# EasyEDA Pro project 2022-LC-MNT-3.eprj

# Schematic 【蓝桥杯练习题三】智能平衡小车
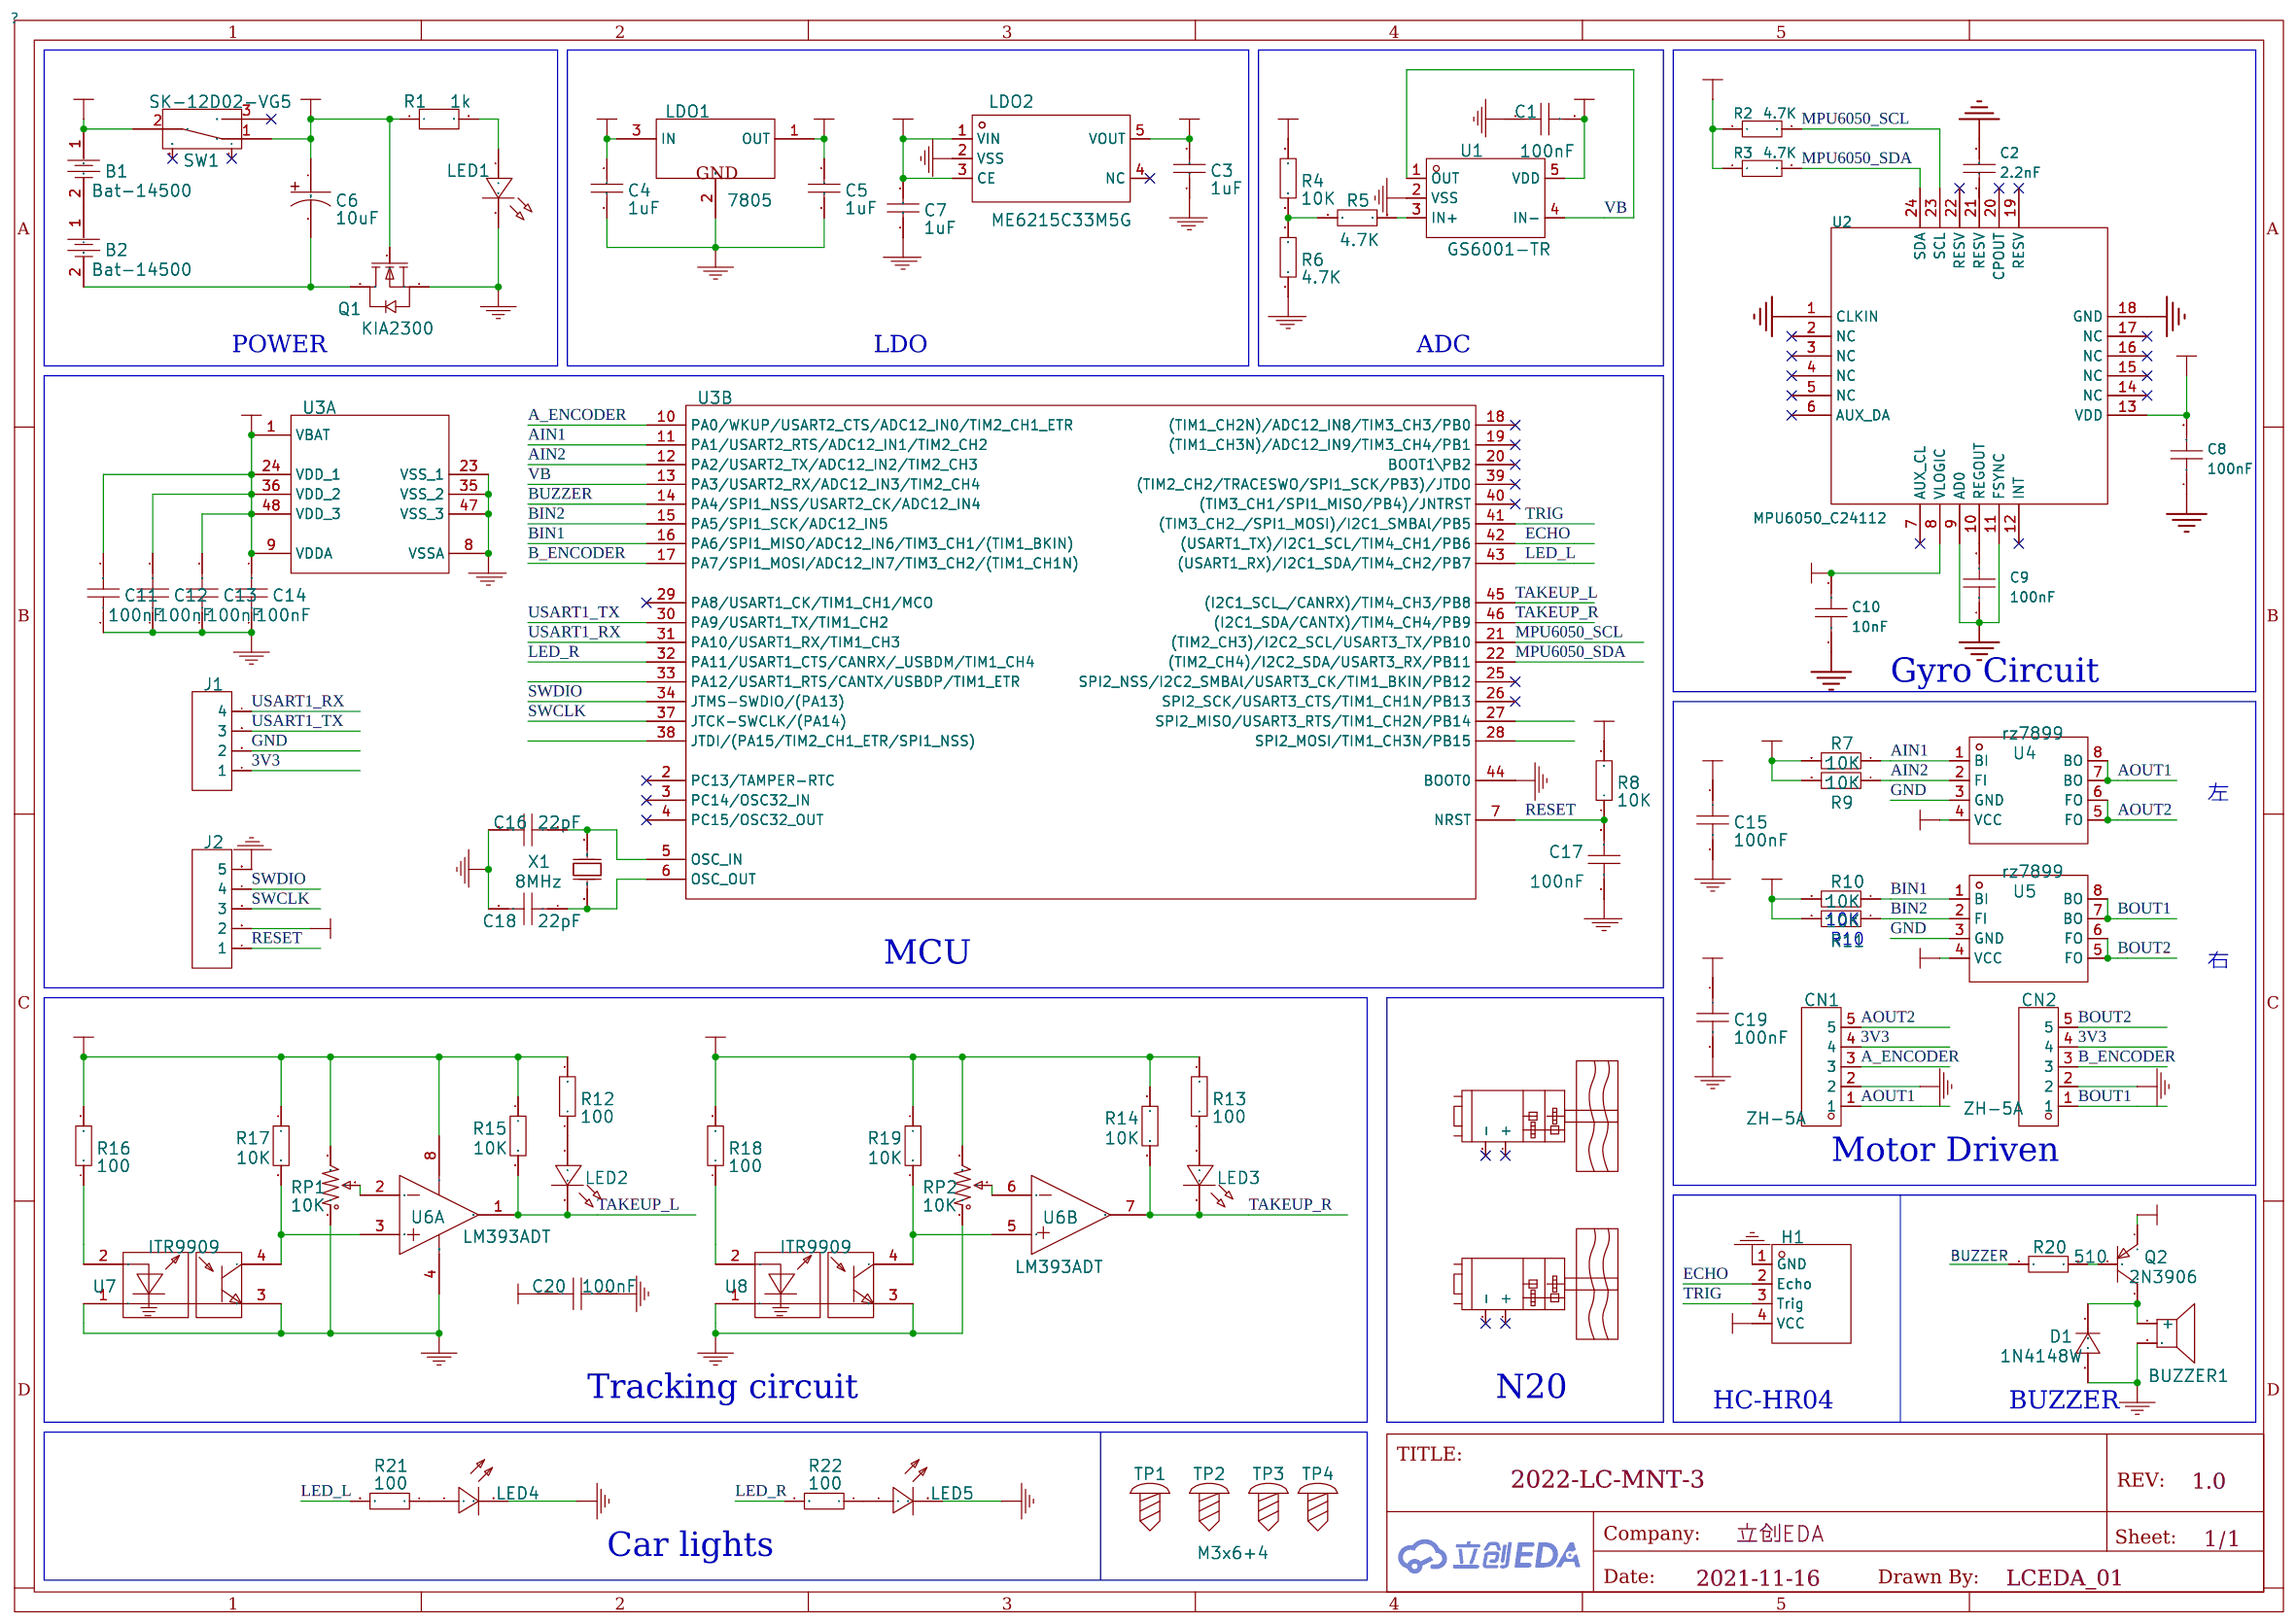
[diagram p0: schematic sheet]

## Parts
ASS_1  直流电机N20  [直流电机N20_水平装配]
ASS_2  直流电机N20  [直流电机N20_水平装配]
B1  Bat-14500  [BAT-5AA_JX]
B2  Bat-14500  [BAT-5AA_JX]
BUZZER1  TMB12A12  [BUZ-TH_BD12.0-P7.60-D0.6-FD]
C1  100nF  [C0603]
C2  2.2nF  [C0603]
C3  1uF  [C0603]
C4  1uF  [C0603]
C5  1uF  [C0603]
C6  10uF  [CAP-SMD_L3.2-W1.6]
C7  1uF  [C0603]
C8  100nF  [C0603]
C9  100nF  [C0603]
C10  10nF  [C0603]
C11  100nF  [C0603]
C12  100nF  [C0603]
C13  100nF  [C0603]
C14  100nF  [C0603]
C15  100nF  [C0603]
C16  22pF  [C0603]
C17  100nF  [C0603]
C18  22pF  [C0603]
C19  100nF  [C0603]
C20  100nF  [C0603]
CN1  ZH-5A  [CONN-TH_5P-P1.50_ZH-5A]
CN2  ZH-5A  [CONN-TH_5P-P1.50_ZH-5A]
D1  1N4148W  [SOD-123FL_L2.6-W1.6-LS3.4-RD]
H1  超声波测距模块_HC-HR04  [HC-HR04]
J1  HDR-M-2.54_1x4  [HDR-M-2.54_1X4]
J2  HDR-M-2.54_1x5  [HDR-M-2.54_1X5]
LDO1  7805  [SOT-89-3_L4.5-W2.5-P1.50-LS4.2-BR]
LDO2  ME6215C33M5G  [SOT-23-5_L3.0-W1.7-P0.95-LS2.8-BR]
LED1  LED-0603_R  [LED0603_RED]
LED2  LED-0805_G  [LED0603_GREEN]
LED3  LED-0805_G  [LED0603_GREEN]
LED4  TJ-L5FCMYGTDLSFLC6TW-A5  [LED-TH-5MM_P2.54-L]
LED5  TJ-L5FCMYGTDLSFLC6TW-A5  [LED-TH-5MM_P2.54-L]
Q1  KIA2300  [SOT-23_L2.9-W1.3-P1.90-LS2.4-BR]
Q2  2N3906  [SOT-23-3_L2.9-W1.6-P1.90-LS2.8-TR-CW]
R1  1k  [R0603]
R2  4.7K  [R0603]
R3  4.7K  [R0603]
R4  10K  [R0603]
R5  4.7K  [R0603]
R6  4.7K  [R0603]
R7  10K  [R0603]
R8  10K  [R0603]
R9  10K  [R0603]
R10  10K  [R0603]
R11  10K  [R0603]
R12  100  [R0603]
R13  100  [R0603]
R14  10K  [R0603]
R15  10K  [R0603]
R16  100  [R0603]
R17  10K  [R0603]
R18  100  [R0603]
R19  10K  [R0603]
R20  510  [R0603]
R21  100  [R0603]
R22  100  [R0603]
RP1  10K  [10K贴片可调电阻]
RP2  10K  [10K贴片可调电阻]
SW1  SK-12D02-VG5  [SW-TH_SK-12D02VG3]
TP1  M3x6+4  [M3铜柱]
TP2  M3x6+4  [M3铜柱]
TP3  M3x6+4  [M3铜柱]
TP4  M3x6+4  [M3铜柱]
U1  GS6001-TR  [SOT-23-5_L3.0-W1.7-P0.95-LS2.8-BR]
U2  MPU6050_C24112  [LQ-QFN-24]
U3  STM32F103C8T6  [LQFP-48_L7.0-W7.0-P0.50-LS9.0-BL]  (sections 1,2)
U4  rz7899  [SOP-8_L4.9-W3.9-P1.27-LS6.0-BL]
U5  rz7899  [SOP-8_L4.9-W3.9-P1.27-LS6.0-BL]
U6  LM393ADT  [SOIC-8_L4.9-W3.9-P1.27-LS6.0-BL]  (sections 1,2)
U7  ITR9909  [OPTO-TH_ITR9909]
U8  ITR9909  [OPTO-TH_ITR9909]
X1  8MHz  [OSC-SMD_L5.0-W3.2]

## Library data of the parts
ASS_1 ASS_2 = 直流电机N20
B1 B2 = Bat-14500
BUZZER1 = TMB12A12: Supplier: LCSC; Manufacturer: HNDZ; Supplier Part: C96079; JLCPCB Part Class: Extended Part
C1 C11-C15 C17 C19 C20 = CC0603KRX7R9BB104: Supplier: LCSC; Manufacturer: YAGEO; Supplier Part: C14663; JLCPCB Part Class: Basic Part
C2 = 2.2nF
C3-C5 C7 = CC0603KRX5R8BB105: Supplier: LCSC; Manufacturer: YAGEO; Supplier Part: C14664; JLCPCB Part Class: Extended Part
C6 = CA45-A-16V-10μF-K: Supplier: LCSC; Supplier Part: C185774; Manufacturer: TORCH; JLCPCB Part Class: Extended Part
C8 C9 = 100nF
C10 = 10nF
C16 C18 = CC0603FRNPO9BN220: Supplier: LCSC; Supplier Part: C326840; Manufacturer: YAGEO; JLCPCB Part Class: Extended Part
CN1 CN2 = ZH-5A: Supplier: LCSC; Manufacturer: BOOMELE; Supplier Part: C27580; JLCPCB Part Class: Extended Part
D1 = 1N4148W: Supplier: LCSC; Manufacturer: Tak Cheong; Supplier Part: C129216
H1 = 超声波测距模块_HC-HR04
J1 = HDR-M-2.54_1x4: Supplier Part: C124378; Supplier: LCSC
J2 = HDR-M-2.54_1x5: Supplier Part: C358687; Supplier: LCSC
LDO1 = CJ78L05: Supplier: LCSC; Manufacturer: CJ; image: //image.lceda.cn/szlcsc/C2079.jpg; Supplier Part: C2079; JLCPCB Part Class: Extend
LDO2 = ME6215C33M5G: Supplier: LCSC; Manufacturer: MICRONE; Supplier Part: C84119; JLCPCB Part Class: Extended Part
LED1 = 19-217/R6C-AL1M2VY/3T: Manufacturer: EVERLIGHT(台湾亿光); Supplier Part: C72044; Supplier: LCSC
LED2 LED3 = NCD0805G1: Manufacturer: 国星光电; Supplier Part: C84260
LED4 LED5 = TJ-L5FCMYGTDLSFLC6TW-A5: Supplier: LCSC; Supplier Part: C331025; Manufacturer: TOGIALED; JLCPCB SMD: Yes; JLCPCB Part Class: Extend
Q1 = KIA2300: Supplier: LCSC; Manufacturer: KIA; Supplier Part: C114186; JLCPCB Part Class: Extended Part
Q2 = 2N3906S-RTK/PS: Supplier: LCSC; Manufacturer: KEC; Supplier Part: C147294
R1 = 1k
R2 R3 = 4.7K
R4 R7-R11 R14 R15 R17 R19 = AR03BTCX1002: Supplier: LCSC; Supplier Part: C319939; Manufacturer: Viking Tech; JLCPCB Part Class: Extended Part
R5 R6 = RS-03K4701FT: Supplier: LCSC; Manufacturer: FH; Supplier Part: C116693; JLCPCB Part Class: Extended Part
R12 R13 R16 R18 R21 R22 = RS-03K101JT: Supplier: LCSC; Manufacturer: FH; Supplier Part: C86983; JLCPCB Part Class: Extended Part
R20 = ERJUP3J511V: Supplier: LCSC; Supplier Part: C543964; Manufacturer: PANASONIC
RP1 RP2 = 10K: Supplier: LCSC; Supplier Part: C515300
SW1 = SK-12D02-VG5: Supplier: LCSC; Supplier Part: C136722; Manufacturer: Rectangular Connectors - Contacts
TP1-TP4 = M3x6+4: Supplier Part: C551320
U1 = GS6001-TR: Supplier: LCSC; Manufacturer: Gainsil; Supplier Part: C157700; JLCPCB Part Class: Extended Part
U2 = MPU-6050_C24112
U3 = STM32F103C8T6: Supplier Part: C8734; Supplier: LCSC
U4 U5 = rz7899: Supplier: LCSC; Manufacturer: RZ; Supplier Part: C92373; JLCPCB Part Class: Extend; JLCPCB SMD: Yes
U6 = LM393ADT: Supplier Part: C136033; Supplier: LCSC; Manufacturer: STMicroelectronics
U7 U8 = ITR9909: Supplier: LCSC; Manufacturer: EVERLIGHT; Supplier Part: C53399; JLCPCB SMD: Yes; JLCPCB Part Class: Extend
X1 = X50328MSB2GI: Supplier: LCSC; Manufacturer: YXC; Supplier Part: C115962; JLCPCB Part Class: Basic Part

## Nets
3V3: C1.2 C3.2 C8.2 C10.2 C11.2 C12.2 C13.2 C14.2 C20.1 CN1.4 CN2.4 J1.1 J2.2 LDO2.5(VOUT) Q2.1(E) R2.1 R3.1 R7.2 R8.2 R9.2 R10.2 R11.2 R12.2 R13.2 R14.1 R15.1 R16.2 R17.1 R18.2 R19.1 RP1.3 RP2.3 U1.5(VDD) U2.8(VLOGIC) U2.13(VDD) U3.1(VBAT) U3.9(VDDA) U3.24(VDD_1) U3.36(VDD_2) U3.48(VDD_3) U6.8(V+)
+5V: C5.2 C7.2 H1.4(VCC) LDO1.1(OUT) LDO2.1(VIN) LDO2.3(CE)
GND: BUZZER1.2 C1.1 C2.2 C3.1 C4.1 C5.1 C7.1 C8.1 C9.1 C10.1 C11.1 C12.1 C13.1 C14.1 C15.2 C16.2 C17.1 C18.2 C19.2 C20.2 CN1.2 CN2.2 D1.2 H1.1(GND) J1.2 J2.5 LDO1.2(GND) LDO2.2(VSS) LED1.2 LED4.2 LED5.2 Q1.2(S) R6.1 RP1.1 RP2.1 U1.2(VSS) U2.1(CLKIN) U2.9(AD0) U2.11(FSYNC) U2.18(GND) U3.8(VSSA) U3.23(VSS_1) U3.35(VSS_2) U3.44(BOOT0) U3.47(VSS_3) U4.3(GND) U5.3(GND) U6.4(GND) U7.1 U7.3 U8.1 U8.3
VCC: C4.2 C6.1 C15.1 C19.1 LDO1.3(IN) Q1.1(G) R1.1 R4.1 SW1.1 U4.4(VCC) U5.4(VCC)
VCC_IN: B1.1 SW1.2
A_ENCODER: CN1.3 U3.10(PA0/WKUP/USART2_CTS/ADC12_IN0/TIM2_CH1_ETR)
AIN1: R7.1 U3.11(PA1/USART2_RTS/ADC12_IN1/TIM2_CH2) U4.1(BI)
AIN2: R9.1 U3.12(PA2/USART2_TX/ADC12_IN2/TIM2_CH3) U4.2(FI)
AOUT1: CN1.1 U4.7(BO) U4.8(BO)
AOUT2: CN1.5 U4.5(FO) U4.6(FO)
B_ENCODER: CN2.3 U3.17(PA7/SPI1_MOSI/ADC12_IN7/TIM3_CH2/(TIM1_CH1N))
BIN1: R10.1 U3.16(PA6/SPI1_MISO/ADC12_IN6/TIM3_CH1/(TIM1_BKIN)) U5.1(BI)
BIN2: R11.1 U3.15(PA5/SPI1_SCK/ADC12_IN5) U5.2(FI)
BOUT1: CN2.1 U5.7(BO) U5.8(BO)
BOUT2: CN2.5 U5.5(FO) U5.6(FO)
BUZZER: R20.1 U3.14(PA4/SPI1_NSS/USART2_CK/ADC12_IN4)
ECHO: H1.2(Echo) U3.42((USART1_TX)/I2C1_SCL/TIM4_CH1/PB6)
LED_L: R21.2 U3.43((USART1_RX)/I2C1_SDA/TIM4_CH2/PB7)
LED_R: R22.2 U3.32(PA11/USART1_CTS/CANRX/ USBDM/TIM1_CH4)
MPU6050_SCL: R2.2 U2.23(SCL) U3.21((TIM2_CH3)/I2C2_SCL/USART3_TX/PB10)
MPU6050_SDA: R3.2 U2.24(SDA) U3.22((TIM2_CH4)/I2C2_SDA/USART3_RX/PB11)
RESET: C17.2 J2.1 R8.1 U3.7(NRST)
SWCLK: J2.3 U3.37(JTCK-SWCLK/(PA14))
SWDIO: J2.4 U3.34(JTMS-SWDIO/(PA13))
TAKEUP_L: LED2.2 R15.2 U3.45((I2C1_SCL /CANRX)/TIM4_CH3/PB8) U6.1(OUT)
TAKEUP_R: LED3.2 R14.2 U3.46((I2C1_SDA/CANTX)/TIM4_CH4/PB9) U6.7(OUT)
TRIG: H1.3(Trig) U3.41((TIM3_CH2 /SPI1_MOSI)/I2C1_SMBAl/PB5)
USART1_RX: J1.4 U3.31(PA10/USART1_RX/TIM1_CH3)
USART1_TX: J1.3 U3.30(PA9/USART1_TX/TIM1_CH2)
VB: U1.1(OUT) U1.4(IN-) U3.13(PA3/USART2_RX/ADC12_IN3/TIM2_CH4)
$1N77: R5.2 U1.3(IN+)
$1N78: R4.2 R5.1 R6.2
$1N269: R16.1 U7.2
$1N271: R17.2 U6.3(IN+) U7.4
$1N290: RP1.2 U6.2(IN-)
$1N433: C18.1 U3.6(OSC_OUT) X1.1(OSC1)
$1N434: C16.1 U3.5(OSC_IN) X1.2(OSC2)
$1N816: B2.2 C6.2 Q1.3(D)
$1N817: LED1.1 R1.2
$1N876: RP2.2 U6.6(IN-)
$1N886: R19.2 U6.5(IN+) U8.4
$1N892: R18.1 U8.2
$1N1091: B1.2 B2.1
$1N1098: LED2.1 R12.1
$1N1111: LED4.1 R21.1
$1N1112: LED5.1 R22.1
$1N1113: LED3.1 R13.1
$1N2605: C2.1 U2.21(RESV)
$1N3949: C9.2 U2.10(REGOUT)
$1N4059: Q2.2(B) R20.2
$1N4066: BUZZER1.1(+) D1.1 Q2.3(C)

Not connected (* = marked no-connect by the designer): ASS_1 1(+)* 2(-)*; ASS_2 1(+)* 2(-)*; LDO2 4(NC)*; SW1 3* 4* 5*; U2 2(NC)* 3(NC)* 4(NC)* 5(NC)* 6(AUX_DA)* 7(AUX_CL)* 12(INT)* 14(NC)* 15(NC)* 16(NC)* 17(NC)* 19(RESV)* 20(CPOUT)* 22(RESV)*; U3 2(PC13/TAMPER-RTC)* 3(PC14/OSC32_IN)* 4(PC15/OSC32_OUT)* 18((TIM1_CH2N)/ADC12_IN8/TIM3_CH3/PB0)* 19((TIM1_CH3N)/ADC12_IN9/TIM3_CH4/PB1)* 20(BOOT1\PB2)* 25(SPI2_NSS/I2C2_SMBAl/USART3_CK/TIM1_BKIN/PB12)* 26(SPI2_SCK/USART3_CTS/TIM1_CH1N/PB13)* 27(SPI2_MISO/USART3_RTS/TIM1_CH2N/PB14) 28(SPI2_MOSI/TIM1_CH3N/PB15) 29(PA8/USART1_CK/TIM1_CH1/MCO)* 33(PA12/USART1_RTS/CANTX/USBDP/TIM1_ETR) 38(JTDI/(PA15/TIM2_CH1_ETR/SPI1_NSS)) 39((TIM2_CH2/TRACESWO/SPI1_SCK/PB3)/JTDO)* 40((TIM3_CH1/SPI1_MISO/PB4)/JNTRST)*

## Notes on the sheet
- POWER
- LDO
- ADC
- Gyro Circuit
- 左
- 10K
- R10
- MCU
- 右
- Motor Driven
- Tracking circuit
- N20
- HC-HR04
- BUZZER
- Car lights

# Board PCB
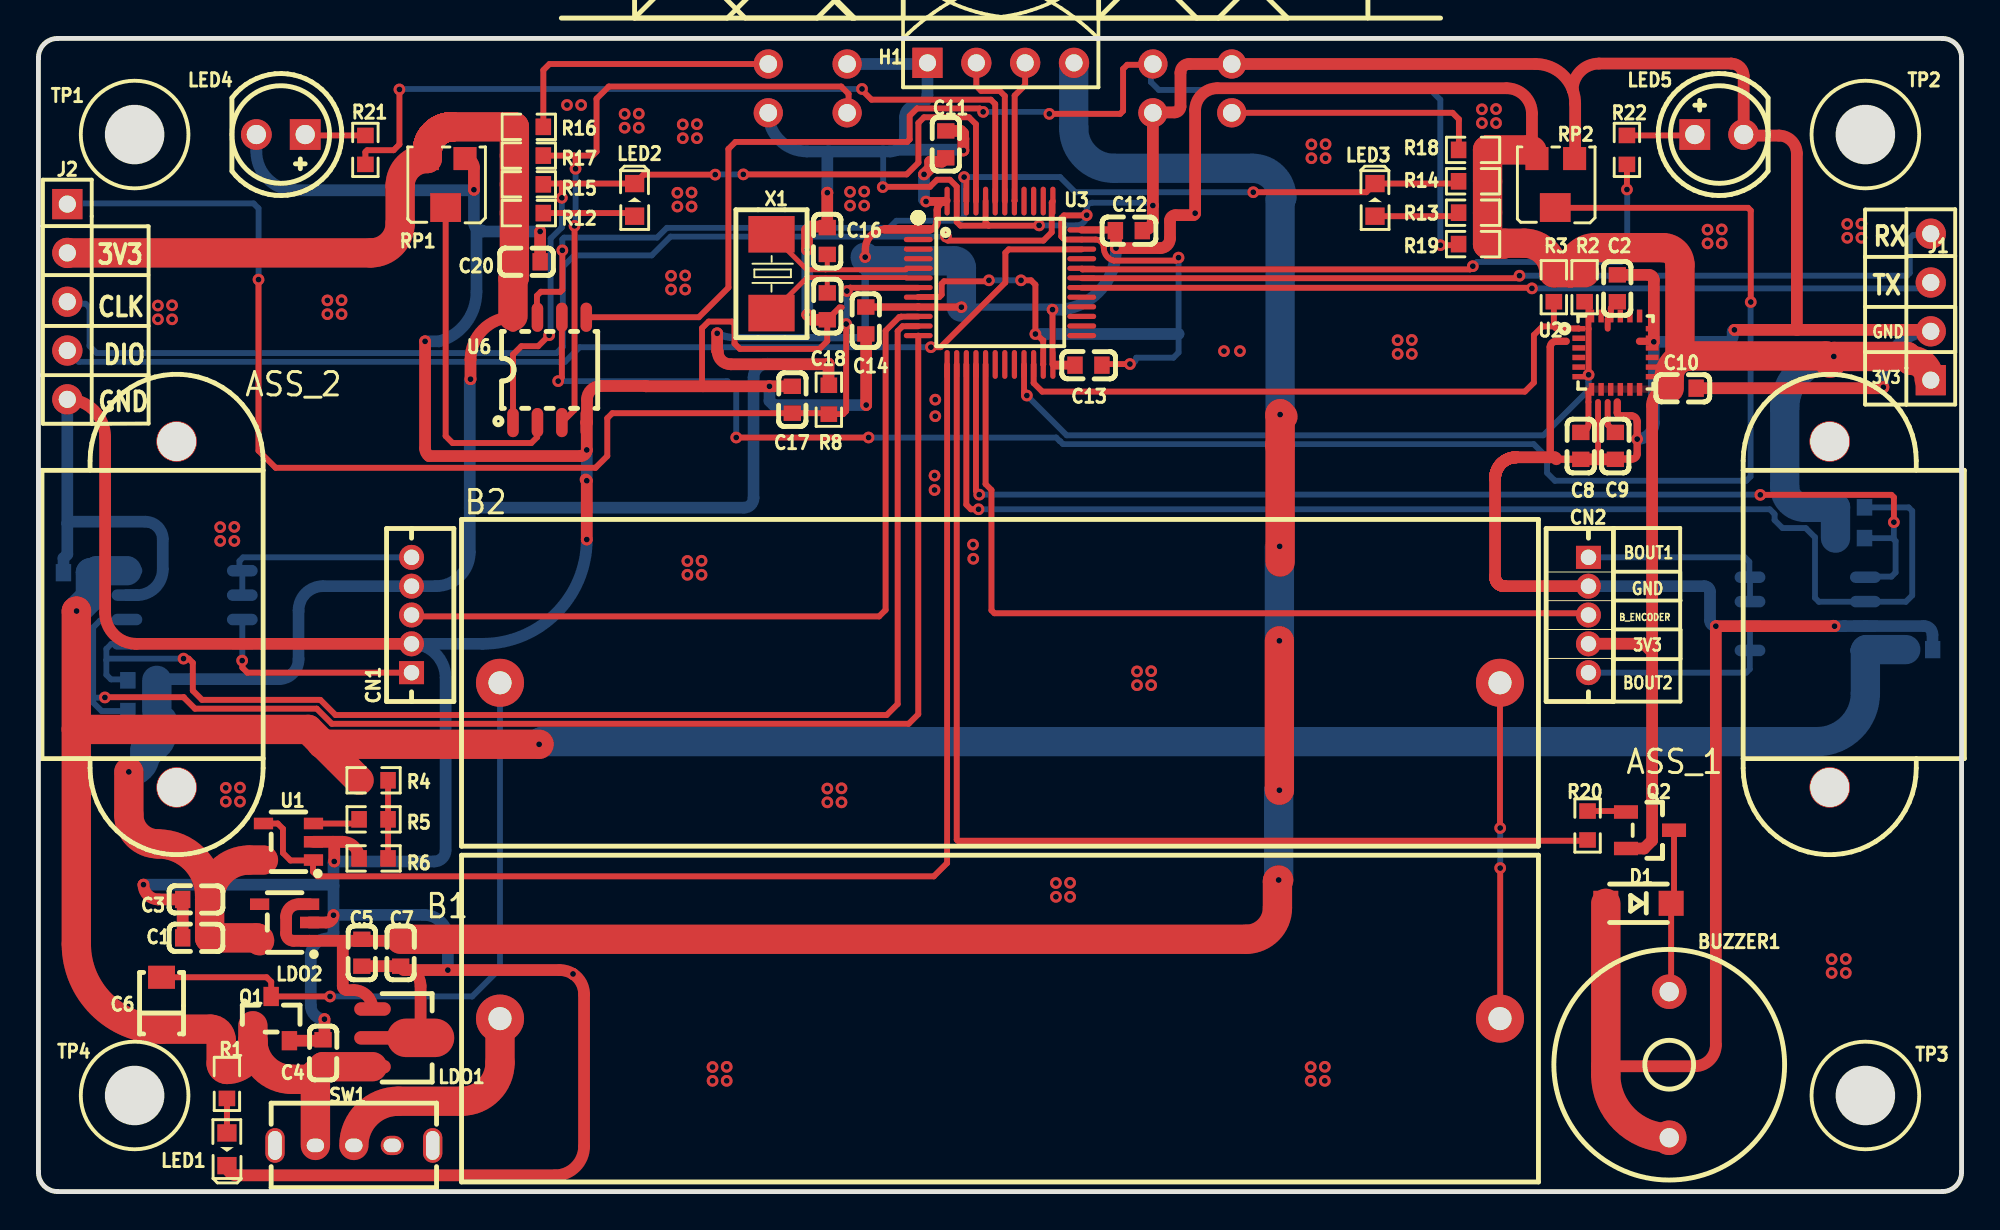
[diagram p1: board, top side]
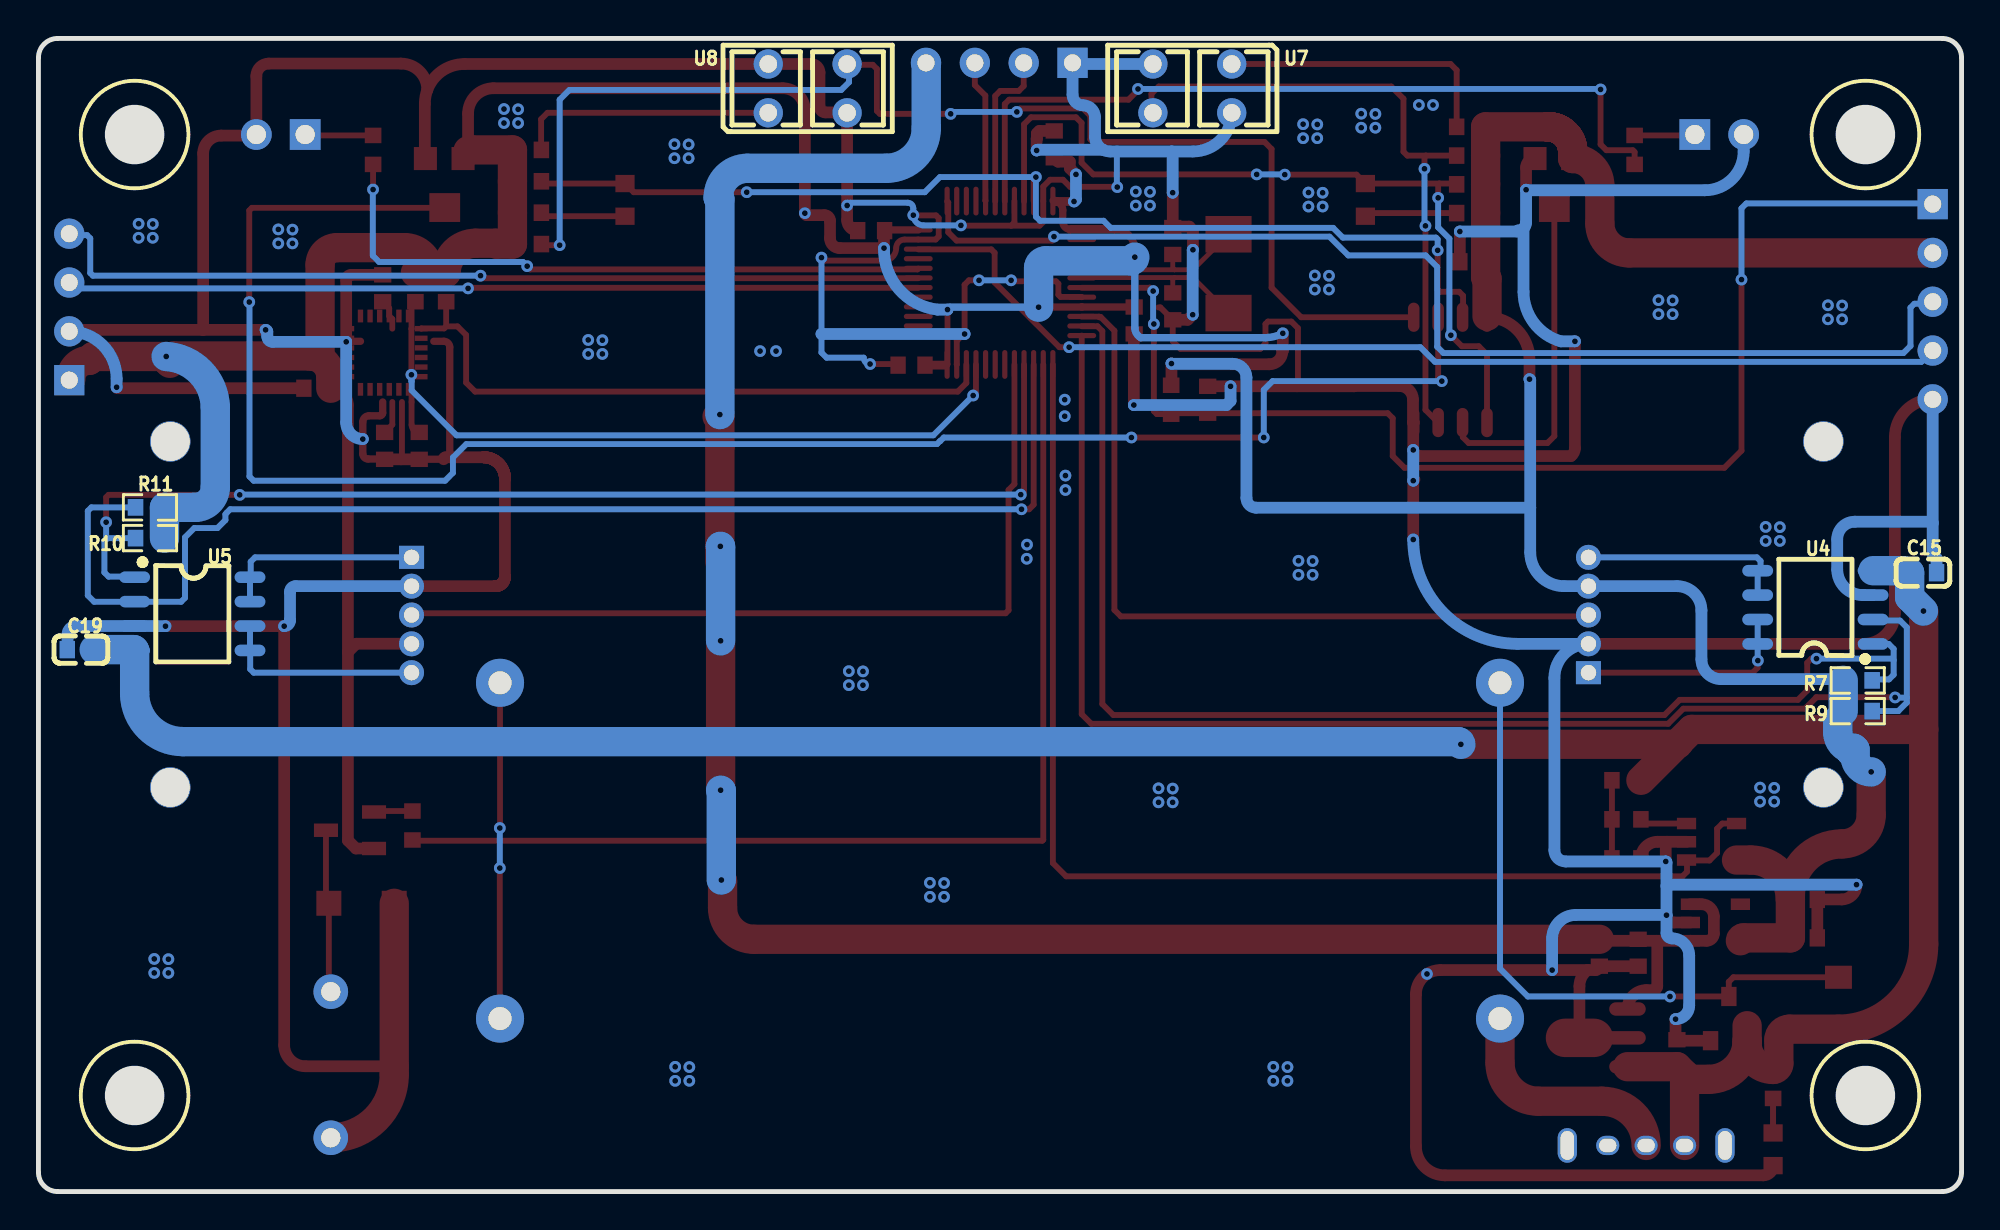
[diagram p2: board, bottom side, seen from below]

Outline 100 x 60 mm; copper layers: Top Layer, Bottom Layer. Coordinates in mm from the lower left corner of the outline.
Outline path: 0,59 arc(0.29,59.71) 1,60 99,60 arc(99.71,59.71) 100,59 100,1 arc(99.71,0.29) 99,0 1,0 arc(0.29,0.29) 0,1 0,59
Stack: Top Layer 0.035mm / Dielectric1 1.51mm FR4 er 4.5 / Bottom Layer 0.035mm

## Design rules (mm)
net $1N434: DP1
net $1N433: DP1
template: 用户自定义配置
spacing Default (default): track to track 0.152, other pairs 0 to 0.152
track width Default (default): min 0.305, default 0.305, max 25.4
track width PWR: min 0.305, default 0.61, max 2.54
differential pair differentialPair (default): width min 0.127, default 0.254, max 2.54; gap min 0.152, default 0.152
via Default (default): diameter min 0.61, default 0.61, max 100.025; hole min 0.305, default 0.305, max 59.995
net GND uses PWR
net VCC uses PWR
net VCC_IN uses PWR
net 3V3 uses PWR
net +5V uses PWR

## Placement (name value [footprint] x y rotation side)
ASS_1  直流电机N20  [直流电机N20_水平装配]  88.65 30.03 270 top
ASS_2  直流电机N20  [直流电机N20_水平装配]  11.68 30.03 90 top
B1  Bat-14500  [BAT-5AA_JX]  24 9 0 top
B2  Bat-14500  [BAT-5AA_JX]  76 26.47 180 top
BUZZER1  TMB12A12  [BUZ-TH_BD12.0-P7.60-D0.6-FD]  84.8 6.6 270 top
C1  100nF  [C0603]  8.2 13.2 0 top
C2  2.2nF  [C0603]  82.1 47 90 top
C3  1uF  [C0603]  8.2 15.2 0 top
C4  1uF  [C0603]  14.8 7.2 270 top
C5  1uF  [C0603]  16.81 12.43 90 top
C6  10uF  [CAP-SMD_L3.2-W1.6]  6.4 9.8 90 top
C7  1uF  [C0603]  18.83 12.43 90 top
C8  100nF  [C0603]  80.2 38.8 90 top
C9  100nF  [C0603]  82 38.8 90 top
C10  10nF  [C0603]  85.5 41.8 180 top
C11  100nF  [C0603]  47.18 54.49 270 top
C12  100nF  [C0603]  56.7 50 180 top
C13  100nF  [C0603]  54.6 43 180 top
C14  100nF  [C0603]  43.02 45.33 90 top
C15  100nF  [C0603]  2 32.2 180 bottom
C16  22pF  [C0603]  41.02 49.46 90 top
C17  100nF  [C0603]  39.2 41.2 270 top
C18  22pF  [C0603]  41.02 46.06 270 top
C19  100nF  [C0603]  97.8 28.2 0 bottom
C20  100nF  [C0603]  25.39 48.38 0 top
CN1  ZH-5A  [CONN-TH_5P-P1.50_ZH-5A]  19.4 30 90 top
CN2  ZH-5A  [CONN-TH_5P-P1.50_ZH-5A]  80.6 30 270 top
D1  1N4148W  [SOD-123FL_L2.6-W1.6-LS3.4-RD]  83.2 15 0 top
H1  超声波测距模块_HC-HR04  [HC-HR04]  50.04 58.73 0 top
J1  HDR-M-2.54_1x4  [HDR-M-2.54_1X4]  98.4 46.03 90 top
J2  HDR-M-2.54_1x5  [HDR-M-2.54_1X5]  1.5 46.3 270 top
LDO1  7805  [SOT-89-3_L4.5-W2.5-P1.50-LS4.2-BR]  18.62 8 180 top
LDO2  ME6215C33M5G  [SOT-23-5_L3.0-W1.7-P0.95-LS2.8-BR]  12.8 14 0 top
LED1  LED-0603_R  [LED0603_RED]  9.8 2.2 270 top
LED2  LED-0805_G  [LED0603_GREEN]  31 51.6 90 top
LED3  LED-0805_G  [LED0603_GREEN]  69.5 51.6 90 top
LED4  TJ-L5FCMYGTDLSFLC6TW-A5  [LED-TH-5MM_P2.54-L]  12.6 55 180 top
LED5  TJ-L5FCMYGTDLSFLC6TW-A5  [LED-TH-5MM_P2.54-L]  87.4 55 0 top
Q1  KIA2300  [SOT-23_L2.9-W1.3-P1.90-LS2.4-BR]  12.1 9 270 top
Q2  2N3906  [SOT-23-3_L2.9-W1.6-P1.90-LS2.8-TR-CW]  83.8 18.8 180 top
R1  1k  [R0603]  9.8 5.6 270 top
R2  4.7K  [R0603]  80.4 47.06 270 top
R3  4.7K  [R0603]  78.8 47.06 270 top
R4  10K  [R0603]  17.43 21.4 0 top
R5  4.7K  [R0603]  17.43 19.37 180 top
R6  4.7K  [R0603]  17.43 17.33 0 top
R7  10K  [R0603]  5.4 26.6 0 bottom
R8  10K  [R0603]  41.1 41.2 90 top
R9  10K  [R0603]  5.4 25 0 bottom
R10  10K  [R0603]  94.2 34 180 bottom
R11  10K  [R0603]  94.2 35.6 180 bottom
R12  100  [R0603]  25.5 50.91 180 top
R13  100  [R0603]  74.6 50.93 0 top
R14  10K  [R0603]  74.6 52.57 180 top
R15  10K  [R0603]  25.5 52.41 0 top
R16  100  [R0603]  25.5 55.4 180 top
R17  10K  [R0603]  25.5 53.9 0 top
R18  100  [R0603]  74.6 54.2 0 top
R19  10K  [R0603]  74.6 49.3 180 top
R20  510  [R0603]  80.55 19.05 90 top
R21  100  [R0603]  17 54.2 270 top
R22  100  [R0603]  82.6 54.2 270 top
RP1  10K  [10K贴片可调电阻]  21.2 52.7 180 top
RP2  10K  [10K贴片可调电阻]  78.9 52.7 180 top
SW1  SK-12D02-VG5  [SW-TH_SK-12D02VG3]  16.4 2.4 0 top
TP1  M3x6+4  [M3铜柱]  5 55 0 top
TP2  M3x6+4  [M3铜柱]  95 55 0 top
TP3  M3x6+4  [M3铜柱]  95 5 0 top
TP4  M3x6+4  [M3铜柱]  5 5 0 top
U1  GS6001-TR  [SOT-23-5_L3.0-W1.7-P0.95-LS2.8-BR]  13 18.2 0 top
U2  MPU6050_C24112  [LQ-QFN-24]  80.1 44.9 270 top
U3  STM32F103C8T6  [LQFP-48_L7.0-W7.0-P0.50-LS9.0-BL]  50 47.29 270 top
U4  rz7899  [SOP-8_L4.9-W3.9-P1.27-LS6.0-BL]  7.6 30.4 90 bottom
U5  rz7899  [SOP-8_L4.9-W3.9-P1.27-LS6.0-BL]  92 30.06 270 bottom
U6  LM393ADT  [SOIC-8_L4.9-W3.9-P1.27-LS6.0-BL]  26.58 42.75 0 top
U7  ITR9909  [OPTO-TH_ITR9909]  40 57.4 0 bottom
U8  ITR9909  [OPTO-TH_ITR9909]  60 57.4 180 bottom
X1  8MHz  [OSC-SMD_L5.0-W3.2]  38.12 47.76 90 top

## Footprints (pads in the part's own frame, mm; a bottom-side part is the same pattern mirrored in y, then rotated)
10K贴片可调电阻
  rect 1.2x1.2 smd: 1(-0.98,-1.05) 3(0.98,-1.05)
  rect 1.6x1.5 smd: 2(0.026,1.5)
BAT-5AA_JX
  round 2.5 hole 1.2: 1(0,0) 2(51.999,0)
BUZ-TH_BD12.0-P7.60-D0.6-FD
  round 1.8 hole 1: 1(-3.8,0) 2(3.8,0)
C0603
  rect 0.8x0.9 smd: 1(-0.7,0) 2(0.7,0)
CAP-SMD_L3.2-W1.6
  rect 1.2x1.4 smd: 1(-1.35,0) 2(1.35,0)
CONN-TH_5P-P1.50_ZH-5A
  rect 1.2x1.3 hole 0.8: 1(-3,0)
  round 1.3 hole 0.8: 2(-1.5,0) 3(0,0) 4(1.5,0) 5(3,0)
HC-HR04
  rect 1.575x1.575 hole 0.889: 1(-3.81,0)
  round 1.575 hole 0.889: 2(-1.27,0) 3(1.27,0) 4(3.81,0)
HDR-M-2.54_1X4
  rect 1.575x1.575 hole 0.889: 1(-3.81,0)
  round 1.575 hole 0.889: 2(-1.27,0) 3(1.27,0) 4(3.81,0)
HDR-M-2.54_1X5
  rect 1.575x1.575 hole 0.889: 1(-5.08,0)
  round 1.575 hole 0.889: 2(-2.54,0) 3(0,0) 4(2.54,0) 5(5.08,0)
LED0603_GREEN
  rect 0.9x1 smd: 1(-0.85,0) 2(0.85,0)
LED0603_RED
  rect 0.9x1 smd: 1(-0.85,0) 2(0.85,0)
LED-TH-5MM_P2.54-L
  rect 1.6x1.6 hole 1: 1(-1.27,0)
  round 1.6 hole 1: 2(1.27,0)
LQ-QFN-24
  rect 0.28x0.665 smd: 1(0,0) 2(0.5,0) 3(1,0) 4(1.5,0) 5(2,0) 6(2.5,0) 13(2.5,3.816) 14(2,3.816) 15(1.5,3.816) 16(1,3.816) 17(0.5,3.816) 18(0,3.816)
  rect 0.665x0.28 smd: 7(3.158,0.658) 8(3.158,1.158) 9(3.158,1.658) 10(3.158,2.158) 11(3.158,2.658) 12(3.158,3.158) 19(-0.658,3.158) 20(-0.658,2.658) 21(-0.658,2.158) 22(-0.658,1.659) 23(-0.658,1.158) 24(-0.658,0.658)
LQFP-48_L7.0-W7.0-P0.50-LS9.0-BL
  oval 0.27x1.5 smd: 1(-2.75,-4.25) 2(-2.25,-4.25) 3(-1.75,-4.25) 4(-1.25,-4.25) 5(-0.75,-4.25) 6(-0.25,-4.25) 7(0.25,-4.25) 8(0.75,-4.25) 9(1.25,-4.25) 10(1.75,-4.25) 11(2.25,-4.25) 12(2.75,-4.25) 25(2.75,4.25) 26(2.25,4.25) 27(1.75,4.25) 28(1.25,4.25) 29(0.75,4.25) 30(0.25,4.25) 31(-0.25,4.25) 32(-0.75,4.25) 33(-1.25,4.25) 34(-1.75,4.25) 35(-2.25,4.25) 36(-2.75,4.25)
  oval 1.5x0.27 smd: 13(4.25,-2.75) 14(4.25,-2.25) 15(4.25,-1.75) 16(4.25,-1.25) 17(4.25,-0.75) 18(4.25,-0.25) 19(4.25,0.25) 20(4.25,0.75) 21(4.25,1.25) 22(4.25,1.75) 23(4.25,2.25) 24(4.25,2.75) 37(-4.25,2.75) 38(-4.25,2.25) 39(-4.25,1.75) 40(-4.25,1.25) 41(-4.25,0.75) 42(-4.25,0.25) 43(-4.25,-0.25) 44(-4.25,-0.75) 45(-4.25,-1.25) 46(-4.25,-1.75) 47(-4.25,-2.25) 48(-4.25,-2.75)
OPTO-TH_ITR9909
  round 1.524 hole 0.914: 1(-2.05,1.27) 2(-2.05,-1.27) 3(2.05,-1.27) 4(2.05,1.27)
OSC-SMD_L5.0-W3.2
  rect 1.9x2.4 smd: 1(-2.05,0) 2(2.05,0)
R0603
  rect 0.806x0.864 smd: 1(-0.753,0) 2(0.753,0)
SOD-123FL_L2.6-W1.6-LS3.4-RD
  rect 1.3x1.3 smd: 1(1.7,0) 2(-1.7,0)
SOIC-8_L4.9-W3.9-P1.27-LS6.0-BL
  oval 0.6x1.52 smd: 1(-1.905,-2.74) 2(-0.635,-2.74) 3(0.635,-2.74) 4(1.905,-2.74) 5(1.905,2.74) 6(0.635,2.74) 7(-0.635,2.74) 8(-1.905,2.74)
SOP-8_L4.9-W3.9-P1.27-LS6.0-BL
  oval 0.6x1.6 smd: 1(-1.905,-3) 2(-0.635,-3) 3(0.635,-3) 4(1.905,-3) 5(1.905,3) 6(0.635,3) 7(-0.635,3) 8(-1.905,3)
SOT-23-3_L2.9-W1.6-P1.90-LS2.8-TR-CW
  rect 1.25x0.7 smd: 1(1.25,0.95) 2(1.25,-0.95) 3(-1.25,0)
SOT-23-5_L3.0-W1.7-P0.95-LS2.8-BR
  rect 1x0.6 smd: 1(1.3,-0.95) 2(1.3,0) 3(1.3,0.95) 4(-1.3,0.95) 5(-1.3,-0.95)
SOT-23_L2.9-W1.3-P1.90-LS2.4-BR
  rect 1x0.8 smd: 1(1.15,-0.95) 2(1.15,0.95) 3(-1.15,0)
SOT-89-3_L4.5-W2.5-P1.50-LS4.2-BR
  oval 1.9x0.7 smd: 1(1.25,-1.501) 3(1.25,1.501)
  oval 3.5x2 smd: 2(-1.25,0)
  oval 2.1x0.7 smd: 4(1.151,0)
SW-TH_SK-12D02VG3
  oval 1.2x1 hole 0.9x0.7: 1(-1.998,0) 2(0.001,0) 3(1.998,0)
  oval 1x1.8 hole 0.7x1.5: 4(4.099,0) 5(-4.099,0)
直流电机N20_水平装配
  round 2.1 hole 2: 1(-9,4.5) 2(9,4.5)
  round 2 hole 2.1: 3(8.999,4.501) 4(-8.999,4.501)

## Nets
As in the schematic.

Pads without a net: ASS_1 1 2 3 4; ASS_2 1 2 3 4; LDO1 4; LDO2 4; SW1 3 4 5; U2 2 3 4 5 6 7 12 14 15 16 17 19 20 22; U3 2 3 4 18 19 20 25 26 29 39 40

## Via types
v1: diameter 0.61, hole 0.305, Top Layer to Bottom Layer, 185 vias

## Routing (per net, layer and track width the routed paths; a pad name or vN(x,y) marks a point on that pad's centre or on a via; arc(x,y) is an arc through that point)
3V3: length 342.5
  Top Layer w0.305: U3.24 52.75,43.02 arc(52.74,43.03) 52.73,43.04 v1(52.73,45.89) ; 80.6,41.67 80.6,39.9 arc(80.48,39.62) C8.2
  Top Layer w0.381: C14.2 45.74,46.03 U3.9 ; U3.36 55.96,50.04 arc(55.99,50.03) C12.2 ; 45.75,46.02 47.99,46.02 arc(47.99,46.02) v1(47.99,46.02) ; 42.98,48.66 arc(42.99,48.67) 43,48.68 43,49.04 arc(43.3,49.76) 44.03,50.06 ; 46.34,50.06 arc(46.62,50.18) 46.74,50.46 46.74,51.06 arc(46.76,51.22) 46.84,51.37 arc(46.93,51.45) 47.03,51.52 arc(47.13,51.55) 47.24,51.56
  Top Layer w0.457: 46.34,50.06 44.03,50.06 ; 47.14,51.54 47.14,51.52 v1(46.15,51.52) ; C13.2 52.84,43
  Top Layer w0.61: CN2.4 80.6,28.5 83.48,28.5 83.91,28.07 ; Q2.1 83.49,17.85 83.91,18.27 83.91,28.07 ; v1(46.05,52.93) 46.37,53.24 46.37,53.59 46.98,53.59 C11.2 ; v1(35.29,44.66) 35.29,43.74 35.32,43.72 arc(35.52,43.24) 35.99,43.05 41.05,43.05 arc(41.07,43.06) v1(41.08,43.08) 41.08,41.97 arc(41.09,41.96) R8.2 ; v1(22.47,42.27) 22.47,43.28 arc(23.11,44.85) U6.8 ; 60.15,50.98 60.15,56.25 arc(60.49,57.07) 61.3,57.41 76.34,57.41 arc(77.27,57.02) 77.66,56.09 77.66,54.01 arc(77.74,53.83) RP2.3 ; 83.91,28.07 83.91,40.91 arc(84.17,41.54) C10.2 ; C12.2 arc(56.03,49.99) 56.04,49.95 56.03,49.94 v1(56.03,49.09) 58.33,49.09 arc(58.69,49.24) 58.84,49.6 58.84,50.51 arc(58.92,50.72) 59.13,50.81 60.05,50.81 arc(60.12,50.83) v1(60.15,50.91)
  Top Layer w1.524: 24.75,55.4 R17.1 R15.1 24.75,47.58 24.67,47.5 24.67,45.55 ; U1.5 10.95,17.25 arc(9.5,16.65) C3.2 ; 20.22,54.12 RP1.3 arc(19.22,53.34) 18.81,52.34 18.81,50.37 arc(18.36,49.29) 17.28,48.84 J2.2 ; 20.22,54.12 arc(20.6,55.03) 21.5,55.4 ; 20.22,54.12 arc(20.6,55.03) 21.5,55.4 ; 20.22,54.12 arc(20.6,55.03) 21.5,55.4 ; 20.22,54.12 arc(20.6,55.03) 21.5,55.4 ; 20.22,54.12 arc(20.6,55.03) 21.5,55.4 ; 20.22,54.12 arc(20.6,55.03) 21.5,55.4 ; 20.22,54.12 arc(20.6,55.03) 21.5,55.4 ; 20.22,54.12 arc(20.6,55.03) 21.5,55.4 ; 20.22,54.12 arc(20.6,55.03) 21.5,55.4 ; 20.22,54.12 arc(20.6,55.03) 21.5,55.4 ; 20.22,54.12 arc(20.6,55.03) 21.5,55.4 ; 20.22,54.12 arc(20.6,55.03) 21.5,55.4 ; 20.22,54.12 arc(20.6,55.03) 21.5,55.4 ; 20.22,54.12 arc(20.6,55.03) 21.5,55.4 ; 20.22,54.12 arc(20.6,55.03) 21.5,55.4 ; 20.22,54.12 arc(20.6,55.03) 21.5,55.4 ; 20.22,54.12 arc(20.6,55.03) 21.5,55.4 ; 20.22,54.12 arc(20.6,55.03) 21.5,55.4 ; 20.22,54.12 arc(20.6,55.03) 21.5,55.4 ; 20.22,54.12 arc(20.6,55.03) 21.5,55.4 ; 20.22,54.12 arc(20.6,55.03) 21.5,55.4 ; 20.22,54.12 arc(20.6,55.03) 21.5,55.4 ; 20.22,54.12 arc(20.6,55.03) 21.5,55.4 ; C3.2 C1.2 11.35,13.2 arc(11.46,13.16) LDO2.5 ; C3.2 8.9,15.4 arc(8.11,17.3) 6.21,18.09 arc(5.14,18.53) 4.7,19.6 v1(4.7,21.84) ; 93.23,43.25 93.25,43.27 93.23,43.28 ; 93.23,43.25 93.15,43.25 ; 93.23,43.25 93.23,43.28 ; 93.23,43.25 arc(93.24,43.21) 93.24,43.17 arc(93.19,43.15) 93.17,43.1 ; 85.36,43.62 85.36,48.23 arc(85.1,48.86) 84.47,49.12 80.97,49.12 arc(80.04,48.73) 79.66,47.81 ; 79.66,47.81 R2.1 ; 79.66,47.81 R3.1 arc(78.35,48.89) 77.26,49.34 76.23,49.34 76.18,49.3 75.35,49.3 R13.2 R18.2 77.47,54.2 arc(77.57,54.19) 77.66,54.16 ; 93.23,43.28 93.23,43.33 v1(93.36,43.45) 97.16,43.45 97.36,43.25 arc(98.03,42.97) 98.31,42.3 ; 93.23,43.28 93.23,43.28 arc(93.13,43.42) 92.97,43.48 85.9,43.48 arc(85.8,43.47) 85.7,43.46 arc(85.05,43.08) 84.8,42.37 C10.2 ; 21.5,55.4 R16.2
  Bottom Layer w0.381: v1(47.99,46.02) 52.6,46.02 arc(52.69,45.98) v1(52.73,45.89) ; v1(42.99,48.62) 42.99,44.95 arc(42.91,44.65) 42.68,44.43 36.19,44.43 arc(35.73,44.49) v1(35.29,44.66)
  Bottom Layer w0.61: v1(46.05,52.93) 46.05,51.62 v1(46.15,51.52) ; 22.43,35.58 22.43,42.23 arc(22.44,42.26) v1(22.47,42.27) ; 22.43,35.58 22.43,33.27 arc(21.91,32.02) 20.66,31.5 CN1.4 14.79,31.5 arc(13.9,31.13) 13.53,30.23 13.53,27.69 arc(13.22,26.96) 12.5,26.66 6.22,26.66 arc(6.17,26.64) R7.2 ; 22.43,35.58 36.68,35.58 arc(37.04,35.73) 37.19,36.09 37.19,42.36 arc(37.39,42.86) 37.9,43.07 41.07,43.07 arc(41.08,43.07) v1(41.08,43.08) ; v1(52.73,45.89) 53.25,45.89 arc(55.26,46.95) v1(56.03,49.09)
  Bottom Layer w1.524: 6.44,24.53 6.44,23.89 arc(6.22,23.31) 5.67,23 ; v1(47.99,46.02) 47.99,48.06 arc(47.89,48.32) 47.62,48.43 43.18,48.43 arc(43.05,48.49) v1(42.99,48.62) ; 93.45,34 93.45,35.6 91.86,35.6 arc(91.11,35.91) 90.81,36.66 90.81,40.82 arc(91.57,42.63) v1(93.36,43.45) ; R7.2 R9.2 ; 5.67,23 5.61,23.06 5.54,22.99 arc(5.6,22.99) 5.67,23 ; 5.67,23 5.77,22.91 5.54,22.67 arc(5.29,22.08) v1(4.7,21.84)
+5V: length 113.9
  Top Layer w0.61: LDO2.3 13.52,14.95 arc(13.07,14.76) 12.88,14.31 12.88,13.43 arc(12.99,13.16) 13.26,13.05 14.1,13.05 ; 14.1,13.05 15.84,13.05 ; 14.1,13.05 arc(14.1,13.05) LDO2.1 ; 15.84,13.05 18.76,13.05 arc(18.81,13.07) C7.2 ; 15.84,13.05 arc(15.83,13.04) 15.82,13.03 15.82,10.69 arc(15.88,10.54) 16.03,10.48 16.39,10.48 arc(17.08,10.19) LDO1.1
  Top Layer w1.524: C7.2 62.79,13.13 arc(63.95,13.61) 64.43,14.76 64.43,16.15 arc(64.45,16.19) v1(64.49,16.21) ; 64.57,32.76 64.57,38.8 arc(64.56,38.82) 64.54,38.83 ; 64.57,40.36 64.57,40.47 arc(64.58,40.41) 64.57,40.36 ; 64.57,40.36 64.57,39.08 ; v1(64.53,20.88) v1(64.53,28.66) ; 64.71,40.33 arc(64.7,40.31) 64.69,40.3
  Bottom Layer w1.524: v1(64.53,28.66) 64.53,33.56 arc(64.53,33.57) v1(64.54,33.57) ; v1(64.49,16.21) 64.49,20.85 arc(64.5,20.87) v1(64.53,20.88) ; v1(64.57,40.43) 64.57,51.63 64.66,51.72 arc(64.21,52.8) 63.13,53.24 55.92,53.24 arc(54.45,53.85) 53.84,55.33 53.84,58.72 arc(53.84,58.73) H1.4
GND: length 556.7
  Top Layer w0.305: 34.56,41.9 34.51,41.95 34.51,44.92 34.85,45.27 36.07,45.27 36.19,45.14 36.19,44.12 36.47,43.85 40.61,43.85 41.02,44.25 C18.2 41.66,46 41.77,46 ; v1(56.76,43.06) 55.36,43.06 arc(55.32,43.04) C13.1 ; 49.42,50.26 52.02,50.26 v1(52.03,50.27) ; 49.42,50.26 49.25,50.42 49.25,51.54 ; 49.42,50.26 47.94,50.26 47.75,50.45 47.75,52.29 47.4,52.65 46.72,52.65 46.35,52.28 43.92,52.28 v1(43.9,52.27) ; U3.23 52.25,43.04 52.25,44.29 52.22,44.29 51.89,44.62 v1(51.84,44.62) 51.84,47.19 51.61,47.41 v1(51.09,47.41) ; 45.75,46.54 45.76,46.55 46.85,46.55 46.96,46.67 46.96,47.24 47.09,47.36 49.37,47.36 v1(49.42,47.41) ; 81.1,41.08 81.1,38.14 arc(81.11,38.11) 81.14,38.1 ; v1(54.51,50.81) 54.5,50.79 53.33,50.79 53.19,50.65 53.19,49.7 53.35,49.54 54.96,49.54 arc(55.27,49.41) 55.4,49.1 arc(55.54,48.68) 55.91,48.44 59.13,48.44 arc(59.24,48.48) v1(59.28,48.6)
  Top Layer w0.381: 82.1,41.08 82.1,40.51 arc(82.14,40.41) 82.25,40.37 82.82,40.37 arc(83.04,40.27) 83.13,40.05 v1(83.13,39.15) 83.13,38.38 arc(83.06,38.2) 82.87,38.12 82.02,38.12 arc(82.01,38.11) C9.1 ; 83.26,44.24 83.97,44.24 arc(83.99,44.23) v1(84,44.21) ; 79.44,44.24 78.92,44.24 arc(78.7,44.15) 78.61,43.93 78.61,38.22 arc(78.61,38.21) 78.6,38.21 ; 78.93,38.11 80.19,38.11 arc(80.2,38.1) C8.1
  Top Layer w0.61: 91.44,44.84 98.32,44.84 arc(98.38,44.81) J1.2 ; 91.44,44.84 v1(88.19,44.84) ; 91.44,44.84 91.44,54.01 arc(91.16,54.67) 90.5,54.95 88.72,54.95 arc(88.69,54.96) LED5.2 88.67,58.05 arc(88.48,58.5) 88.02,58.69 81.15,58.69 arc(80.18,58.29) 79.78,57.32 ; v1(43.04,40.92) 43.04,44.61 C14.1 ; CN1.2 5.08,28.5 arc(3.94,28.97) 3.47,30.12 3.47,39.25 arc(2.89,40.64) J2.5 ; U1.2 15.33,18.2 ; 15.33,18.2 15.81,18.2 arc(16.42,17.95) R6.1 ; 15.33,18.2 arc(15.36,18.18) 15.38,18.15 v1(15.38,17.18) ; C17.1 v1(38.01,41.9) 31.59,41.9 arc(31.58,41.9) 31.57,41.92 29.24,41.92 arc(28.73,41.71) 28.52,41.2 28.52,40.05 arc(28.51,40.02) U6.4 arc(28.5,40.01) 28.51,39.99 v1(28.51,38.59) arc(28.42,38.36) 28.19,38.27 20.31,38.27 arc(20.16,38.45) 20.1,38.68 v1(20.1,44.24) ; v1(84,44.21) 84,47.43 arc(83.92,47.62) 83.72,47.7 C2.2 ; C20.2 v1(26.09,49.95) ; C1.1 C3.1 6.23,15.2 arc(5.69,15.43) v1(5.46,15.97) ; LDO1.2 19.87,10.69 arc(19.76,11.16) 19.45,11.52 ; LDO2.2 14.96,14 arc(15.23,14.11) v1(15.34,14.38) ; C8.1 C9.1 ; v1(39.97,49) 39.97,50.02 40.16,50.21 40.97,50.21 C16.2 41.02,51.97 arc(41.02,51.97) v1(41.02,51.97) ; v1(22.64,52.13) 22.64,53.29 arc(22.51,53.61) RP1.1 ; v1(39.98,45.62) 40.24,45.36 C18.2 ; v1(14.87,8.97) 14.87,7.97 arc(14.85,7.92) C4.1 arc(14.79,7.86) 14.75,7.85 Q1.2 ; CN2.2 76.24,31.5 ; 76.24,31.5 arc(75.89,31.65) 75.74,32 ; 76.24,31.5 arc(75.89,31.65) 75.74,32 ; 76.24,31.5 arc(75.89,31.65) 75.74,32 ; 76.24,31.5 arc(75.89,31.65) 75.74,32 ; 76.24,31.5 arc(75.89,31.65) 75.74,32 ; 76.24,31.5 arc(75.89,31.65) 75.74,32 ; 76.24,31.5 arc(75.89,31.65) 75.74,32 ; 76.24,31.5 arc(75.89,31.65) 75.74,32 ; 76.24,31.5 arc(75.89,31.65) 75.74,32 ; 76.24,31.5 arc(75.89,31.65) 75.74,32 ; 19.45,11.52 v1(21.29,11.52) 27.11,11.52 arc(27.47,11.47) v1(27.8,11.32) arc(28.22,10.87) 28.37,10.27 28.37,2.35 arc(27.93,1.29) 26.86,0.84 10.31,0.84 arc(9.95,0.99) LED1.2 ; 19.45,11.52 19.04,11.52 arc(18.89,11.58) C7.1 C5.1 ; C11.1 47.95,55.19 48.08,55.06 48.08,54.79 48.09,54.78 v1(48.09,54.17) ; 75.74,32 75.74,37.1 ; 75.74,37.1 arc(76.07,37.88) 76.85,38.21 ; 75.74,37.1 arc(76.07,37.88) 76.85,38.21 ; 75.74,37.1 arc(76.07,37.88) 76.85,38.21 ; 75.74,37.1 arc(76.07,37.88) 76.85,38.21 ; 75.74,37.1 arc(76.07,37.88) 76.85,38.21 ; 75.74,37.1 arc(76.07,37.88) 76.85,38.21 ; 75.74,37.1 arc(76.07,37.88) 76.85,38.21 ; 75.74,37.1 arc(76.07,37.88) 76.85,38.21 ; 75.74,37.1 arc(76.07,37.88) 76.85,38.21 ; 75.74,37.1 arc(76.07,37.88) 76.85,38.21 ; 76.85,38.21 78.83,38.21 arc(78.9,38.18) 78.93,38.11 ; C10.1 95.88,41.8 arc(95.92,41.82) v1(95.94,41.85) ; v1(28.51,33.93) v1(28.51,36.99) arc(28.49,37.03) 28.45,37.05 ; 79.78,57.32 arc(79.03,58.3) 77.85,58.67 U8.1 59.83,58.67 arc(59.52,58.54) 59.38,58.22 59.38,56.46 arc(59.3,56.24) 59.08,56.15 57.97,56.15 arc(57.96,56.15) U8.3 v1(57.95,51.31) 57.95,50.55 arc(57.79,50.16) C12.1 ; 79.78,57.32 arc(79.88,56.97) 79.91,56.61 79.91,53.78 arc(79.9,53.76) RP2.1 ; 81.5,6.52 arc(81.5,6.52) 81.5,6.52 86.12,6.52 arc(86.9,6.84) 87.22,7.62 v1(87.22,29.42) 93.31,29.42 arc(93.35,29.44) v1(93.4,29.42)
  Top Layer w1.524: D1.2 81.5,6.1 arc(82.47,3.77) BUZZER1.2
  Bottom Layer w0.305: v1(49.42,47.41) v1(51.09,47.41) ; v1(59.28,48.6) 59.28,43.66 59.02,43.39 57.09,43.39 arc(56.98,43.14) 56.73,43.03 arc(56.75,43.04) v1(56.76,43.06) ; 43.92,54.12 43.92,52.29 v1(43.9,52.27) ; v1(52.03,50.27) 53.97,50.27 arc(54.35,50.43) v1(54.51,50.81) 54.51,51.16 arc(54.59,51.37) 54.8,51.45 57.8,51.45 arc(57.91,51.41) v1(57.95,51.31)
  Bottom Layer w0.61: v1(38.01,41.9) 38.01,41.14 38.23,40.92 v1(43.04,40.92) ; v1(39.98,45.62) 39.98,48.99 v1(39.97,49) ; v1(15.34,14.38) 15.34,15.91 ; v1(15.34,14.38) 15.34,13.45 arc(15.26,13.26) 15.06,13.17 arc(14.42,12.91) 14.16,12.27 14.16,9.68 arc(14.37,9.18) v1(14.87,8.97) ; v1(15.34,14.38) arc(15.35,14.39) 15.35,14.39 20.05,14.39 arc(20.93,14.03) 21.29,13.16 v1(21.29,11.52) ; 15.34,15.91 15.34,17.14 arc(15.35,17.16) v1(15.38,17.18) 20.59,17.18 arc(21,17.35) 21.17,17.76 21.17,26.73 arc(20.65,27.98) CN1.2 23.08,28.5 arc(26.92,30.09) v1(28.51,33.93) ; 15.34,15.91 arc(15.32,15.95) 15.28,15.97 v1(5.46,15.97) ; 59.28,44.63 59.28,44.62 v1(51.84,44.62) ; v1(95.94,41.85) 95.94,42.3 arc(96.66,44.04) J1.2 ; 41.07,54.12 39.96,54.12 arc(38.54,54.71) U7.1 ; 41.07,54.12 44.28,54.12 arc(44.47,54.14) 44.65,54.21 ; 41.07,54.12 arc(41.04,54.1) 41.02,54.07 v1(41.02,51.97) ; 44.65,54.21 48.06,54.21 arc(48.08,54.2) v1(48.09,54.17) ; 44.65,54.21 arc(44.95,54.49) 45.06,54.89 45.06,55.9 arc(45.24,56.34) 45.68,56.52 arc(46.07,56.68) 46.23,57.07 H1.1 arc(46.21,58.69) 46.17,58.67 U7.3 ; v1(20.1,44.24) 20.83,44.24 arc(22.24,45.2) 22.78,46.81 22.78,50.12 ; CN2.2 86.63,31.5 arc(86.83,31.41) 86.92,31.21 86.92,29.72 arc(87.01,29.51) v1(87.22,29.42) ; v1(93.4,29.42) 93.89,29.42 93.9,29.43 U5.3 98.05,29.43 arc(98.36,29.3) 98.49,28.99 98.49,28.21 arc(98.49,28.2) C19.2 ; J2.5 1.5,34.78 ; 1.5,34.78 1.5,33.16 1.3,32.95 C15.2 ; 1.5,34.78 arc(1.52,34.83) 1.58,34.85 5.55,34.85 arc(6.2,34.59) 6.46,33.94 6.46,32.38 arc(6.07,31.43) 5.12,31.03 U4.3 ; v1(26.09,49.95) 23.11,49.95 arc(23.08,49.97) 23.06,50 arc(22.91,50.03) 22.78,50.12 ; LED4.2 11.33,54.12 arc(11.92,52.69) 13.35,52.1 22.62,52.1 arc(22.64,52.11) v1(22.64,52.13) 22.64,50.42 arc(22.68,50.26) 22.78,50.12 ; v1(28.51,36.99) v1(28.51,38.59) ; v1(83.13,39.15) arc(83.74,39.41) 84,40.02 v1(84,44.21) 87.82,44.21 arc(88.02,44.3) 88.1,44.49 88.1,44.75 arc(88.13,44.81) v1(88.19,44.84)
  vias: v1(6.21,46.1) v1(6.21,45.39) v1(6.95,46.11) v1(6.95,45.39) v1(9.45,34.57) v1(9.45,33.85) v1(9.74,21.01) v1(9.74,20.29) v1(10.19,34.58) v1(10.19,33.85) v1(10.48,21.02) v1(10.48,20.29) v1(15.02,46.37) v1(15.03,45.65) v1(15.76,46.38) v1(15.76,45.65) v1(27.48,56.54) v1(28.22,56.54) v1(30.48,56.07) v1(30.48,55.36) v1(31.22,56.08) v1(31.22,55.36) v1(32.89,47.65) v1(32.89,46.94) v1(33.22,51.97) v1(33.22,51.25) v1(33.5,55.53) v1(33.5,54.81) v1(33.63,47.66) v1(33.63,46.94) v1(33.74,32.81) v1(33.75,32.09) v1(33.96,51.98) v1(33.96,51.25) v1(34.24,55.54) v1(34.24,54.81) v1(34.48,32.82) v1(34.48,32.09) v1(35.05,6.48) v1(35.05,5.76) v1(35.79,6.49) v1(35.79,5.76) v1(41.02,20.97) v1(41.02,20.25) v1(41.76,20.98) v1(41.76,20.25) v1(42.2,52.02) v1(42.2,51.3) v1(42.94,52.03) v1(42.94,51.3) v1(46.63,41.2) v1(46.63,40.34) v1(46.6,37.25) v1(46.6,36.5) v1(48.6,33.66) v1(48.61,32.93) v1(52.91,16.05) v1(52.91,15.34) v1(53.65,16.07) v1(53.65,15.34) v1(57.12,27.06) v1(57.13,26.35) v1(57.86,27.08) v1(57.86,26.35) v1(61.65,43.73) v1(62.48,43.73) v1(66.19,54.48) v1(66.19,53.77) v1(66.15,6.48) v1(66.16,5.76) v1(66.93,54.5) v1(66.93,53.77) v1(66.89,6.49) v1(66.89,5.76) v1(70.68,44.3) v1(70.68,43.58) v1(71.41,44.31) v1(71.41,43.58) v1(75.06,56.31) v1(75.06,55.6) v1(75.79,56.33) v1(75.79,55.6) v1(86.79,50.05) v1(86.79,49.34) v1(87.53,50.06) v1(87.53,49.34) v1(93.24,12.09) v1(93.24,11.38) v1(93.98,12.1) v1(93.98,11.38) v1(94.06,50.34) v1(94.06,49.63) v1(94.79,50.36) v1(94.79,49.63)
VCC: length 149.8
  Top Layer w0.61: C4.2 14.8,6.5
  Top Layer w1.524: 14.4,5.84 13.16,5.84 arc(11.74,6.43) Q1.1 ; 14.4,5.84 SW1.1 ; 14.4,5.84 14.4,6.1 C4.2 ; 1.97,24.05 1.97,12.88 arc(3.27,9.75) C6.1 8.95,8.45 arc(9.34,8.29) 9.5,7.9 9.5,6.65 arc(9.59,6.44) R1.1 arc(10.75,6.75) 11.15,7.7 Q1.1 ; 1.97,24.05 14.03,24.05 14.69,23.39 arc(14.72,23.31) 14.8,23.27 ; 1.97,24.05 1.97,30.19 v1(1.98,30.21) ; Q1.1 11.15,8.63 ; 14.8,6.5 LDO1.3 ; v1(26.03,23.27) 14.8,23.27 ; 14.8,23.27 R4.1
  Bottom Layer w1.524: C19.1 95.04,28.2 U5.4 95,25.93 arc(94.26,24.15) 92.48,23.41 26.17,23.41 arc(26.08,23.37) v1(26.03,23.27) ; v1(1.98,30.21) 2.7,30.92 C15.1 2.93,32.2 3.04,32.31 U4.4
VCC_IN: length 12.4
  Top Layer w1.524: B1.1 24,6.7 arc(23.41,5.29) 22,4.7 18.7,4.7 arc(17.07,4.03) SW1.2
A_ENCODER: length 41.4
  Top Layer w0.305: 45.75,45.52 44.86,45.52 44.83,45.49 44.77,45.51 44.05,44.79 44.05,30.26 43.71,29.93 19.47,29.93 CN1.3
AIN1: length 67.8
  Top Layer w0.305: 45.75,45.02 44.93,45.02 44.68,44.77 44.68,25.37 44.11,24.8 15.45,24.8 14.66,25.58 8.51,25.58 8.03,26.07 8.03,27.51 7.81,27.73 v1(7.54,27.73)
  Bottom Layer w0.305: R7.1 4.6,26.65 3.77,26.65 3.53,26.89 3.53,27.65 ; U4.1 3.79,28.5 3.53,28.24 3.53,27.65 ; 3.53,27.65 3.61,27.73 v1(7.54,27.73)
AIN2: length 71.2
  Top Layer w0.305: 3.45,25.72 7.56,25.72 7.56,25.71 8.14,25.13 14.47,25.13 15.26,24.34 45.25,24.34 45.75,24.84 45.75,44.54
  Bottom Layer w0.305: R9.1 3.29,25 2.84,25.44 2.84,25.7 ; 2.84,25.7 3.44,25.7 v1(3.45,25.71) ; 2.84,25.7 2.84,29.36 3.2,29.71 4.55,29.71 U4.2
AOUT1: length 11.4
  Top Layer w0.305: CN1.1 10.86,27 10.6,27.26 10.6,27.61 v1(10.59,27.63)
  Bottom Layer w0.305: U4.7 U4.8 10.6,27.64 v1(10.59,27.63)
AOUT2: length 10.9
  Bottom Layer w0.305: CN1.5 10.64,33 10.45,32.81 10.45,32.45 U4.5 U4.6
B_ENCODER: length 44.1
  Top Layer w0.305: CN2.3 80.51,30.09 49.71,30.09 49.56,30.24 49.56,36.5 49.25,36.81 49.25,43.02
BIN1: length 61.6
  Top Layer w0.305: v1(96.48,34.83) 96.48,36.12 96.35,36.25 v1(89.53,36.25) ; 48.75,43.02 48.75,36.45 48.92,36.28 v1(48.92,36.26)
  Bottom Layer w0.305: 96.48,33.94 96.57,33.85 96.57,32.21 96.35,32 95.03,32 U5.1 ; 96.48,33.94 96.42,34 94.95,34 ; 96.48,33.94 v1(96.48,34.83) ; v1(89.53,36.25) 89.52,36.26 v1(48.92,36.26)
BIN2: length 67.7
  Top Layer w0.305: 48.25,43.02 48.25,35.74 48.49,35.5 v1(48.88,35.5)
  Bottom Layer w0.305: v1(48.88,35.5) 90.03,35.5 90.21,35.32 arc(90.24,35.28) 90.28,35.24 90.28,34.94 90.69,34.52 91.9,34.52 92.38,34.04 92.38,30.89 92.58,30.69 94.99,30.69 U5.2 95.01,30.69 97.1,30.69 97.43,31.02 97.43,35.41 97.25,35.6 94.95,35.6
BOUT1: length 10.5
  Bottom Layer w0.305: U5.7 U5.8 88.96,32 88.96,32.77 88.74,33 CN2.1
BOUT2: length 10.7
  Bottom Layer w0.305: U5.6 U5.5 88.99,28.14 88.99,27.18 88.81,27 CN2.5
BUZZER: length 57.6
  Top Layer w0.305: 47.75,43.02 47.75,18.31 47.8,18.25 80.51,18.25 R20.1
ECHO: length 8.4
  Top Layer w0.305: 50.25,51.52 50.25,57.01 49.99,57.27 49.02,57.27 48.77,57.52 H1.2
LED_L: length 41.9
  Top Layer w0.305: v1(18.77,57.35) 18.77,54.49 18.47,54.18 17.09,54.18 17,54.09 R21.2 ; 49.75,51.52 49.75,56.59 49.53,56.81 43.32,56.81 42.82,57.31 v1(42.82,57.37)
  Bottom Layer w0.305: v1(18.77,57.35) 18.8,57.37 v1(42.82,57.37)
LED_R: length 33.4
  Top Layer w0.305: v1(74.59,48.15) 74.59,48.13 74.43,47.98 54.29,47.98 54.25,48.02 ; v1(82.6,52.14) R22.2
  Bottom Layer w0.305: v1(74.59,48.15) 74.8,48.37 82.28,48.37 82.61,48.7 82.61,52.13 v1(82.6,52.14)
MPU6050_SCL: length 37.4
  Top Layer w0.305: 51.25,43.02 51.25,41.57 v1(51.4,41.42) ; v1(80.61,42.5) 80.61,44.89 80.6,44.9 80.6,46.1 R2.2
  Bottom Layer w0.305: v1(80.61,42.5) 80.61,42.17 80.59,42.16 80.59,41.69 78.26,39.35 53.47,39.35 v1(51.4,41.42)
MPU6050_SDA: length 33.7
  Top Layer w0.305: 80.1,44.9 80.09,44.91 78.91,44.91 78.8,45.02 ; 78.8,45.02 R3.2 ; 78.8,45.02 78.21,45.02 77.76,44.57 77.76,42.09 77.29,41.62 52.2,41.62 51.75,42.07 51.75,43.02
RESET: length 66.1
  Top Layer w0.305: v1(42.04,46.86) 42.22,47.03 42.22,47.02 45.75,47.02 ; v1(42,45.14) 42,40.61 41.85,40.45 41.11,40.45 R8.1 arc(41.08,40.48) 41.05,40.5 C17.2 29.84,40.5 29.58,40.24 29.58,38.27 28.97,37.66 12.33,37.66 11.44,38.55 v1(11.44,47.45)
  Bottom Layer w0.305: v1(11.44,47.45) 11.44,51.16 11.19,51.42 1.53,51.42 J2.1 ; v1(42,45.14) 42.04,45.18 v1(42.04,46.86)
SWCLK: length 60.4
  Top Layer w0.305: 52.75,51.52 52.69,51.46 52.69,49.91 52.26,49.48 47.28,49.48 47.22,49.55 47.22,49.66 v1(47.19,49.69)
  Bottom Layer w0.305: J2.3 1.61,46.19 2.45,46.19 2.65,45.99 2.65,44 3.02,43.63 26.94,43.63 27.27,43.96 27.27,48.11 27.86,48.71 31.89,48.71 32.87,49.69 v1(47.19,49.69)
SWDIO: length 56.3
  Top Layer w0.305: v1(46.41,43.93) 46.91,43.93 50.28,47.3 50.28,48.85 50.45,49.02 54.25,49.02
  Bottom Layer w0.305: v1(46.41,43.93) 28.14,43.93 27.38,43.17 2.09,43.17 J2.4
TAKEUP_L: length 43.3
  Top Layer w0.305: 48.75,51.52 48.75,55.53 48.39,55.9 46.05,55.9 45.76,55.61 45.76,53.54 45.15,52.93 v1(36.65,52.93) ; 27.16,52.45 26.3,52.45 R15.2 ; 27.16,52.45 LED2.2 31.46,52.91 v1(35.19,52.91) ; 27.16,52.45 27.22,52.39 v1(27.22,51.71) ; U6.1 24.68,43.55 25.11,43.99 25.98,43.99 v1(26.56,44.56)
  Bottom Layer w0.305: v1(27.22,51.71) 27.22,50.17 26.63,49.58 26.63,44.63 v1(26.56,44.56) ; v1(35.19,52.91) 35.2,52.93 v1(36.65,52.93)
TAKEUP_R: length 56.2
  Top Layer w0.305: U6.7 25.92,45.52 25.92,46.61 26.12,46.82 27.14,46.82 27.24,46.92 v1(27.24,48.98) ; 48.25,51.52 48.25,52.67 v1(48.13,52.79) ; 73.85,52.57 73.73,52.45 LED3.2 69.05,52 v1(63.17,52)
  Bottom Layer w0.305: v1(63.17,52) 53.91,52 53.12,52.79 v1(48.13,52.79) 48.13,50.73 47.92,50.51 44.62,50.51 44.25,50.14 32.68,50.14 32.17,49.64 27.33,49.64 27.24,49.55 v1(27.24,48.98)
TRIG: length 7.4
  Top Layer w0.305: 50.75,51.55 50.76,51.56 50.76,57.03 51.31,57.57 H1.3
USART1_RX: length 46.2
  Top Layer w0.305: 54.25,47.52 76.91,47.52 77.01,47.63 v1(77.01,47.66)
  Bottom Layer w0.305: v1(77.01,47.66) 97.17,47.66 97.31,47.8 97.31,49.6 97.47,49.76 98.32,49.76 J1.4
USART1_TX: length 44.3
  Top Layer w0.305: 54.25,47.02 77.63,47.02 v1(77.66,47)
  Bottom Layer w0.305: J1.3 98.09,47 v1(77.66,47)
VB: length 64
  Top Layer w0.305: 14.28,17.23 U1.1 ; 14.28,17.23 13.11,17.23 12.71,17.62 12.71,18.88 12.44,19.15 U1.4 ; 14.28,17.23 14.28,16.64 14.52,16.4 46.56,16.4 47.25,17.09 47.25,43.02
$1N77: length 2.5
  Top Layer w0.305: 16.67,19.37 16.46,19.15 U1.3
$1N78: length 4.1
  Top Layer w0.305: 18.18,17.33 R5.1 R4.2
$1N269: length 14.8
  Top Layer w0.305: U7.2 26.57,58.67 26.25,58.35 R16.1
$1N271: length 34.4
  Top Layer w0.305: 27.85,53.9 28.82,53.9 29.02,54.11 29.02,56.86 29.65,57.5 41.75,57.5 42.13,57.12 42.13,56.21 U7.4 ; 27.85,53.9 27.93,53.83 v1(27.93,53.22) ; 27.85,53.9 R17.2 ; U6.3 27.88,40.67 v1(27.88,50.25)
  Bottom Layer w0.305: v1(27.93,53.22) 27.93,50.3 v1(27.88,50.25)
$1N290: length 17.7
  Top Layer w0.305: U6.2 25.93,40 25.93,39.25 25.63,38.95 21.53,38.95 21.17,39.31 RP1.2
$1N433: length 8.6
  Top Layer w0.254: 40.93,47.56 45.11,47.56 ; 40.93,47.56 41.02,47.47 C18.1 ; 40.93,47.56 39.96,47.56 X1.1
$1N434: length 8.6
  Top Layer w0.254: 40.93,47.96 39.96,47.96 X1.2 ; 40.93,47.96 45.11,47.96 ; 40.93,47.96 41.02,48.05 C16.1
$1N816: length 34
  Top Layer w0.305: C6.2 11.87,11.15 12.1,10.91 12.1,10.15 Q1.3 v1(15.16,10.15) arc(15.19,10.16) 15.2,10.19
  Bottom Layer w0.305: v1(15.16,10.15) 22.55,10.15 24,11.6 B2.2
$1N817: length 3.6
  Top Layer w0.305: LED1.1 R1.2 LED1.1
$1N876: length 93.6
  Top Layer w0.305: U6.6 27.22,42.36 v1(27.03,42.17) ; v1(89.04,46.28) 89.04,51.05 88.9,51.19 78.89,51.19 RP2.2 ; v1(36.28,39.24) v1(43.17,39.24)
  Bottom Layer w0.305: v1(36.28,39.24) 36.28,41.71 35.83,42.17 v1(27.03,42.17) ; v1(89.04,46.28) 89.03,46.27 89.03,37.2 88.81,36.99 78.85,36.99 78.45,37.39 78.45,38.19 77.75,38.89 53.28,38.89 53.12,39.05 53.11,39.05 52.92,39.24 v1(43.17,39.24)
$1N886: length 66.3
  Top Layer w0.305: 73.85,49.3 73.79,49.24 v1(72.9,49.24) ; U8.4 57.91,58.63 56.62,58.63 56.4,58.41 56.4,56.23 56.25,56.08 v1(52.57,56.08) ; U6.5 34.34,45.49 35.88,47.03 35.88,54.25 36.25,54.61 45.17,54.61 45.3,54.74 45.3,55.97 45.68,56.36 48.95,56.36 v1(49.12,56.18)
  Bottom Layer w0.305: v1(52.57,56.08) 52.46,56.18 v1(49.12,56.18) ; U8.4 57.85,58.57 57.85,57.73 58.25,57.32 72.39,57.32 72.9,56.81 v1(72.9,49.24)
$1N892: length 13.6
  Top Layer w0.305: R18.1 73.86,54.22 73.86,55.8 73.53,56.13 U8.2
$1N1091: length 17.5
  Top Layer w0.305: v1(76.01,18.92) 76,18.93 B2.1 ; B1.2 76.01,9.01 v1(76.01,16.83)
  Bottom Layer w0.305: v1(76.01,18.92) v1(76.01,16.83)
$1N1098: length 4.8
  Top Layer w0.305: LED2.1 30.84,50.91 R12.1
$1N1111: length 3.1
  Top Layer w0.305: R21.1 13.92,54.95 LED4.1
$1N1112: length 3.5
  Top Layer w0.305: LED5.1 86.08,54.95 R22.1
$1N1113: length 4.4
  Top Layer w0.305: LED3.1 73.66,50.75 R13.1
$1N2605: length 1.6
  Top Layer w0.305: 81.6,44.9 81.6,45.4 81.76,45.56 81.76,45.96 C2.1
$1N3949: length 1.7
  Top Layer w0.305: 81.6,41.08 81.6,39.9 C9.2
$1N4059: length 2
  Top Layer w0.305: R20.2 82.5,19.8 Q2.2
$1N4066: length 8.5
  Top Layer w0.305: BUZZER1.1 84.9,10.5 D1.1 85.05,15.15 Q2.3

## Copper pours and planes (outline as drawn; the poured copper is in the pictures)
3V3 on Top Layer: 80.4,41.94 82.89,41.94 82.89,41.5 80.4,41.5
3V3 on Top Layer: 82.85,42.42 85.45,42.42 85.45,41.31 82.85,41.31
GND on Top Layer: -5.83,63.75 104.08,63.75 104.08,-5.15 -5.83,-5.15
GND on Bottom Layer: -7.01,64.97 110.82,64.97 110.82,-11.59 -7.01,-11.59

## Text on the board
Top Silkscreen Layer: B_ENCODER | BOUT2 | BOUT1 | GND | 3V3 | CLK | DIO | TX | RX
